# EAGLE design 1-WireWeMos (EAGLE 9.0.0)
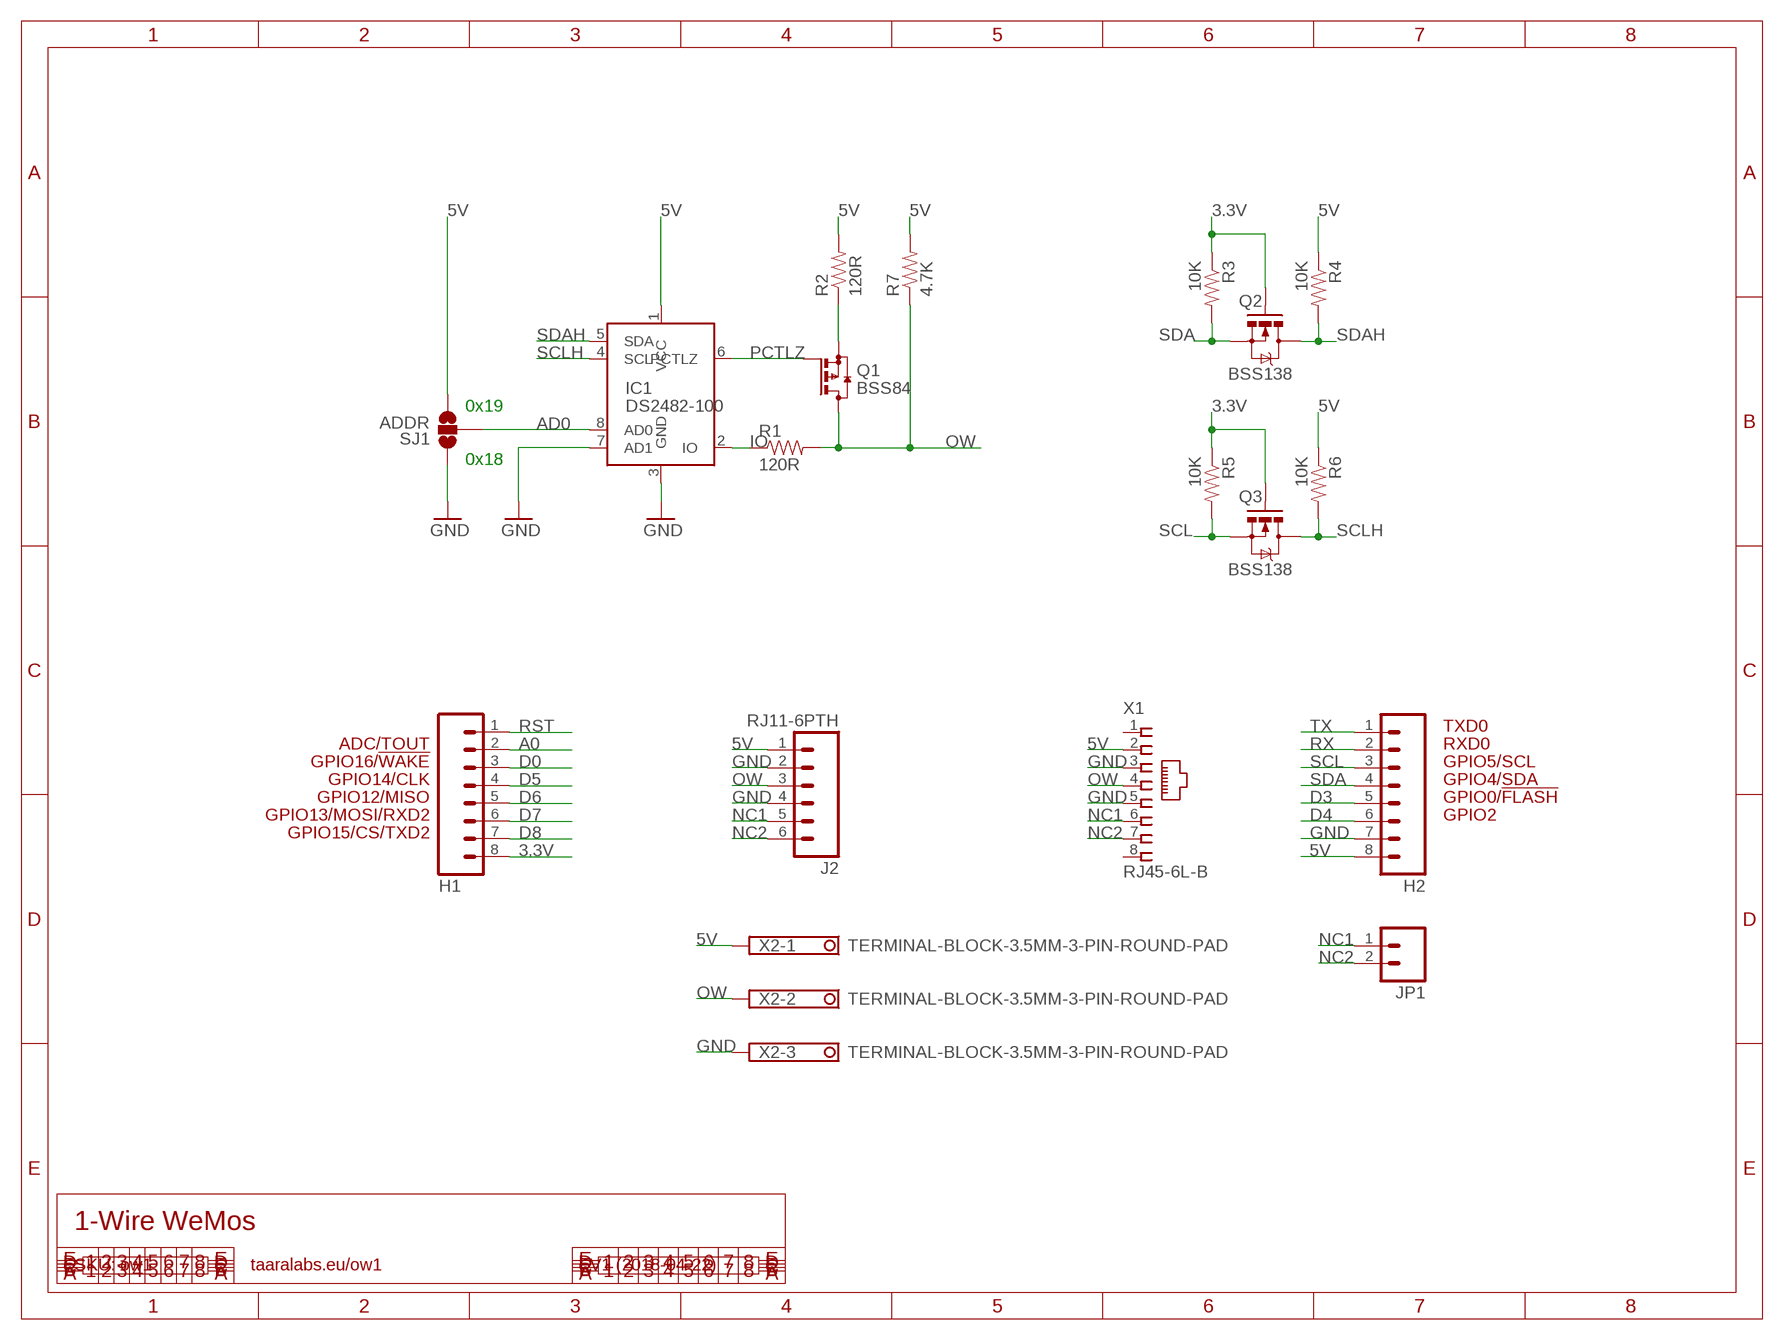
[diagram p0: schematic, sheet 1]

## Parts
H1  M08  [1X08]
H2  M08  [1X08]
IC1  DS2482-100  [SO08]
J2  RJ11-6PTH  [RJ11-6]
JP1  M02PTH  [1X02]
Q1  BSS84  [SOT23]
Q2  BSS138  MOSFET-NCHANNELSMD  [SOT23-3]
Q3  BSS138  MOSFET-NCHANNELSMD  [SOT23-3]
R1  120R  RESISTOR0603-RES  [0603-RES]
R2  120R  RESISTOR0603-RES  [0603-RES]
R3  10K  RESISTOR0603-RES  [0603-RES]
R4  10K  RESISTOR0603-RES  [0603-RES]
R5  10K  RESISTOR0603-RES  [0603-RES]
R6  10K  RESISTOR0603-RES  [0603-RES]
R7  4.7K  RESISTOR0603-RES  [0603-RES]
SJ1  ADDR  SOLDERJUMPER_2WAYPASTE1&2  [SJ_3_PASTE1&2]
X1  RJ45-6L-B  [RJ45-NO-SHIELD]
X2  TERMINAL-BLOCK-3.5MM-3-PIN-ROUND-PAD  [TERMINAL-BLOCK-3-PIN-3.5MM-ROUND-PAD]

## Nets
3.3V: H1.8 Q2.1(G) Q3.1(G) R3.1 R5.1
5V: H2.8 IC1.1(VCC) J2.1 R2.2 R4.1 R6.1 R7.2 SJ1.3 X1.2 X2.1
A0: H1.2
AD0: IC1.8(AD0) SJ1.2
D0: H1.3
D3: H2.5
D4: H2.6
D5: H1.4
D6: H1.5
D7: H1.6
D8: H1.7
GND: H2.7 IC1.3(GND) IC1.7(AD1) J2.2 J2.4 SJ1.1 X1.3 X1.5 X2.3
IO: IC1.2(IO) R1.1
NC1: J2.5 JP1.1 X1.6
NC2: J2.6 JP1.2 X1.7
OW: J2.3 Q1.3(D) R1.2 R7.1 X1.4 X2.2
OWP: Q1.2(S) R2.1
PCTLZ: IC1.6(PCTLZ) Q1.1(G)
RST: H1.1
RX: H2.2
SCL: H2.3 Q3.2(S) R5.2
SCLH: IC1.4(SCL) Q3.3(D) R6.2
SDA: H2.4 Q2.2(S) R3.2
SDAH: IC1.5(SDA) Q2.3(D) R4.2
TX: H2.1
Unconnected: X1.1 X1.8

## Notes on the sheet
- 0x19
- 0x18
- TXD0
- ADC/TOUT | RXD0
- GPIO16/!WAKE | GPIO5/SCL
- GPIO14/CLK | GPIO4/SDA
- GPIO12/MISO | GPIO0/!FLASH
- GPIO13/MOSI/RXD2 | GPIO2
- GPIO15/CS/TXD2
- 1-Wire WeMos
- SKU: ow1 | taaralabs.eu/ow1 | V1 (2018-04-22)

## Library data of the parts
H1 H2 = freetronics-original:M08: Header 8 Standard 8-pin 0.1" header. Use with straight break away headers (SKU : PRT-00116), right angle break away headers (PRT-00553), swiss pins (PRT-00743), machine pins (PRT-00117), and female headers (PRT-00115).
IC1 = icontroller:DS2482-100: Single-Channel 1-Wire Master
J2 = SparkFun:RJ11-6: RJ11 Jack Simple 6 pin RJ11 jack. Commonly found on CAT3 devices and Microchip programmers. SKU: PRT-00132
JP1 = SparkFun:M02: Header 2 Standard 2-pin 0.1" header. Use with straight break away headers (SKU : PRT-00116), right angle break away headers (PRT-00553), swiss pins (PRT-00743), machine pins (PRT-00117), and female headers (PRT-00115). Molex polarized connector foot print use with SKU : PRT-08233 with associated crimp pins and housings.
Q1 = transistor-small-signal:BSS84: P-CHANNEL MOS FET
Q2 Q3 = SparkFun:MOSFET-NCHANNEL
R1-R7 = SparkFun:RESISTOR: Resistor Basic schematic elements and footprints for 0603, 1206, and PTH resistors.
SJ1 = SparkFun:SOLDERJUMPER_2WAY: Solder Jumper 2 way solder jumper
X1 = con-tycoelectronics:RJ45: CORCOM Modular RJ Jacks No Shield Source: www.tycoelectronics.com .. ENG_DS_1654001_1099_RJ_L_0507.pdf; MPN: RJ45-6L-B; OC_FARNELL: unknown; OC_NEWARK: 16R6090
X2 = 3.5mm:TERMINAL-BLOCK-3.5MM-3-PIN: Terminal Block 3.5mm Pitch: 3,5 mm Number of pins: 3 Created by Rembrandt Electronics www.rembrandtelectronics.com

## Net classes
0 default: width 0.203 mm, drill 0.356 mm, clearance 0.152 mm
1 power: width 0.203 mm, clearance 0.152 mm

## Board
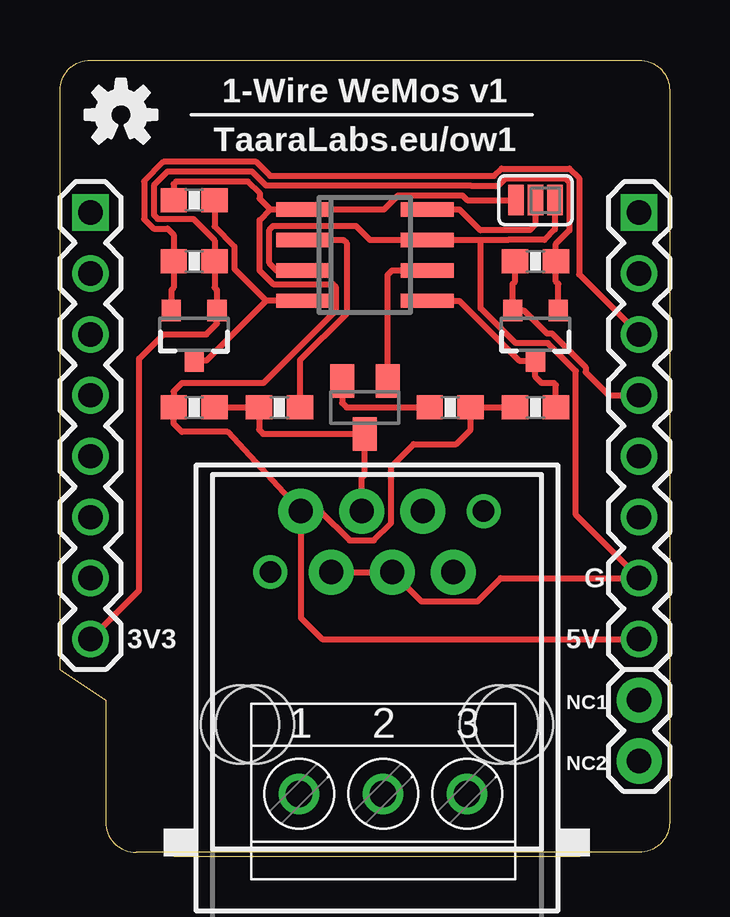
[diagram p1: board, top side]
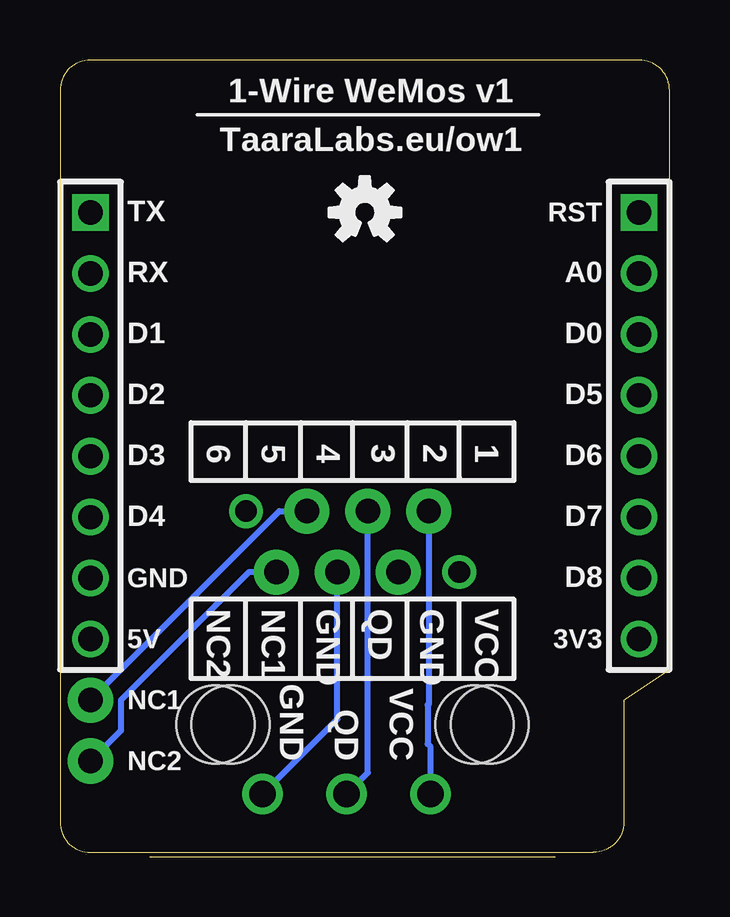
[diagram p2: board, bottom side, seen from below]

Size 25.4 x 33.02 mm. Coordinates in mm from the lower left corner, seen from the top.
Outline: 25.4,31.75 25.4,1.27 arc-90 24.13,0 3.17,0 arc-90 1.91,1.27 1.91,6.35 0,7.62 0,31.75 arc-90 1.27,33.02 24.13,33.02 arc-90 25.4,31.75
Copper layers (1*16): Top 0.035mm / dielectric 1.5mm / Bottom 0.035mm
Design rules "ElectroDragon_2layer_DRU_no_angle_20140221": minimum track width 6mil, minimum drill 12mil, track to track 6mil, track to pad 6mil, pad to pad 6mil, via to via 6mil, smd to smd 6mil, copper to edge 8mil, drill to drill 6mil, minimum pad ring 10mil, minimum via ring 6mil, stop-mask expansion 4mil, vias tented up to drill 100mil, thermal gap 10mil

### Footprints (pad centres in the part's own frame; a part is rotated, then mirrored left to right if it is on the bottom)
1X08 = drill 1.016 square: 1 0,0 | drill 1.016: 2 2.54,0; 3 5.08,0; 4 7.62,0; 5 10.16,0; 6 12.7,0; 7 15.24,0; 8 17.78,0
SO08 = smd 0.6 x 2.2: 1 -1.905,-2.6; 2 -0.635,-2.6; 3 0.635,-2.6; 4 1.905,-2.6; 5 1.905,2.6; 6 0.635,2.6; 7 -0.635,2.6; 8 -1.905,2.6
RJ11-6 = drill 1.016 pad 1.88: 1 1.905,8.89; 2 3.175,6.35; 3 4.445,8.89; 4 5.715,6.35; 5 6.985,8.89; 6 8.255,6.35 | hole 3.251: 0,0; 10.16,0
1X02 = drill 1.016 pad 1.88: 1 0,0; 2 2.54,0
SOT23 = smd 1 x 1.4: 1 -0.95,-1.1; 2 0.95,-1.1; 3 0,1.1
SOT23-3 = smd 0.8 x 0.9: 1 -0.95,-1; 2 0.95,-1; 3 0,1.1
0603-RES = smd 1.1 x 1: 1 -0.85,0; 2 0.85,0
SJ_3_PASTE1&2 = smd 0.635 x 1.27: 1 -0.813,0; 2 0,0; 3 0.813,0
RJ45-NO-SHIELD = drill 0.9 pad 1.4: 1 -4.445,6.35; 2 -3.175,8.89; 3 -1.905,6.35; 4 -0.635,8.89; 5 0.635,6.35; 6 1.905,8.89; 7 3.175,6.35; 8 4.445,8.89 | hole 3.251: -5.715,0; 5.715,0
TERMINAL-BLOCK-3-PIN-3.5MM-ROUND-PAD = drill 1.1 pad 1.7: 1 -3.5,-0.1; 2 0,-0.1; 3 3.5,-0.1

### Placement (x,y rotation side)
H1  1.27,26.67 270 top
H2  24.13,26.67 270 top
IC1  12.7,24.89 270 top
J2  8.13,5.33 0 top
JP1  24.13,6.35 270 top
Q1  12.7,18.54 180 top
Q2  19.81,21.59 180 top
Q3  5.59,21.59 180 top
R1  9.14,18.54 180 top
R2  16.26,18.54 0 top
R3  19.81,24.64 180 top
R4  19.81,18.54 0 top
R5  5.59,24.64 180 top
R6  5.59,27.18 0 top
R7  5.59,18.54 180 top
SJ1  19.81,27.18 180 top
U$1  [OSHW-LOGO-S]  2.54,30.73 0 top
U$2  [OSHW-LOGO-S]  12.7,26.67 0 bottom
X1  13.21,5.33 0 top
X2  13.46,2.54 0 top

### Tracks (layer width: path | path; a pad name or v marks a point on that pad's centre or on a via)
3.3V
  Top 0.254: Q2.1 20.76,23.69 20.66,23.79 R3.1 20.66,25.36 21.22,25.92 21.22,27.93 21.06,28.09 18.57,28.09 18.26,27.78 17.11,27.78 17.02,27.78 8.59,27.78 8.01,28.36 4.48,28.36 3.91,27.79 3.91,26.56 4.07,26.4 5.55,26.4 6.44,25.51 R5.1 6.44,23.53 6.54,23.43 Q3.1 6.54,22.03 6.1,21.59 4.32,21.59 3.3,20.57 3.3,10.92 H1.8
5V
  Top 0.203: 17.07,18.49 R2.2
  Top 0.254: X1.2 10.03,9.78 10.92,8.89 H2.8 | X1.2 10.85,14.22 12.07,13.01 13.08,13.01 13.79,13.72 13.79,16.08 14.73,17.02 16.51,17.02 17.11,17.61 R2.2 R4.1 | X1.2 6.99,17.53 5.08,17.53 4.74,17.87 R7.2 4.74,19.22 5.08,19.56 8.47,19.56 11.48,22.57 11.48,23.57 11.37,23.68 8.88,23.68 8.31,24.25 8.31,26.35 8.76,26.8 | 8.76,26.8 IC1.1 13.51,26.8 13.92,27.21 13.93,27.22 14.08,27.38 16.76,27.38 16.96,27.18 SJ1.3 | 8.76,26.8 8.31,27.25 8.31,27.48 7.84,27.96 4.84,27.96 4.74,27.85 R6.1
  Bottom 0.254: X2.1 9.96,4.4 10.08,4.52 10.08,6.14 10.03,6.2 X1.2
AD0
  Top 0.254: IC1.8 16.64,26.8 17.5,25.93 17.53,25.93 19.58,25.93 19.81,26.16 SJ1.2
GND
  Top 0.254: X1.3 X1.5 15.06,10.46 17.4,10.46 18.36,11.43 H2.7 21.49,14.07 21.49,20.06 20.33,21.22 18.98,21.22 17.53,22.67 17.53,25.53 | IC1.3 9.02,24.26 8.72,24.55 8.72,25.94 8.88,26.11 12.33,26.11 12.91,25.53 IC1.7 17.53,25.53 | 17.53,25.53 18.54,25.53 18.67,25.53 20.19,25.53 20.62,25.96 SJ1.1
  Bottom 0.254: X2.3 13.84,5.56 X1.5
IO
  Top 0.254: IC1.2 11.81,25.53 11.94,25.4 11.94,22.45 9.99,20.51 R1.1
NC1
  Bottom 0.254: JP1.1 16.26,14.22 X1.6
NC2
  Bottom 0.254: X1.7 17.53,11.68 22.86,6.35 22.86,5.08 JP1.2
OW
  Top 0.254: R7.1 R1.2 8.29,17.61 8.47,17.44 Q1.3 12.7,15.75 12.57,15.62 X1.4
  Bottom 0.254: X2.2 12.57,3.33 X1.4
OWP
  Top 0.254: Q1.2 11.75,18.73 11.94,18.54 R2.1
PCTLZ
  Top 0.203: 15.29,24.18 IC1.6
  Top 0.254: Q1.1 13.65,24.06 13.84,24.26 IC1.6
SCL
  Top 0.203: 4.62,24.71 R5.2
  Top 0.254: Q3.2 4.64,23.43 4.74,23.53 R5.2 4.74,25.74 4.49,25.99 3.9,25.99 3.5,26.39 3.5,27.96 4.31,28.77 8.18,28.77 8.75,28.19 18.09,28.19 18.4,28.5 21.23,28.5 21.63,28.1 21.63,24.09 H2.3
SCLH
  Top 0.254: IC1.4 8.59,22.99 | Q3.3 6.1,20.49 8.59,22.99 | 8.59,22.99 7.27,24.31 7.27,25.25 6.44,26.08 R6.2
SDA
  Top 0.254: H2.4 22.86,19.05 21.9,20.01 21.9,20.22 20.5,21.63 20.28,21.63 19.32,22.59 Q2.2 18.86,23.69 18.96,23.79 R3.2
SDAH
  Top 0.254: R4.2 20.66,19.47 20.57,19.56 20.07,19.56 19.81,19.81 Q2.3 19.13,20.49 16.64,22.99 IC1.5

### Text on the board
tPlace: 1-Wire WeMos v1 | TaaraLabs.eu/ow1 | G | 3V3 | 5V | NC1 | NC2
bPlace: 1-Wire WeMos v1 | TaaraLabs.eu/ow1 | RST | TX | A0 | RX | D0 | D1 | D5 | D2 | 1 | 2 | 3 | 4 | 5 | 6 | D6 | D3 | D7 | D4 | D8 | GND | VCC | GND | QD | GND | NC1 | NC2 | 3V3 | 5V | NC1 | VCC | QD | GND | NC2
tValues: o | 0x19|0x18